# Altium schematic sheet isolator.SchDoc
size A
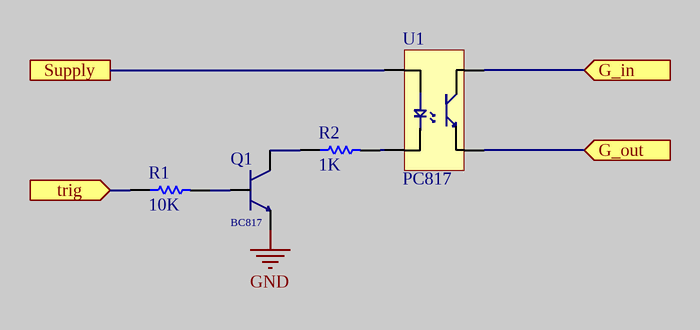
[diagram p0: isolator.SchDoc]

## Parts
Q1  NPN transistor  [NPN]  (value not drawn)
R1  10K  [RESC0603]
R2  1K  [RESC0603]
U1  PC817  [PC817]

## Ports
G_in (in), G_out (in), Supply, trig (in)

## Nets
GND: Q1.2(E)
G_in: U1.4 ; port G_in
G_out: U1.3 ; port G_out
Supply: U1.1 ; port Supply
trig: R1.1 ; port trig
NetQ1_1: Q1.1(B) R1.2
NetQ1_3: Q1.3(C) R2.1
NetR2_2: R2.2 U1.2

## Library data of the parts
Q1 = BC817: 45 V, 0.5 A; Transistor: BC817
R1 R2 = Resistor: 0603,0.1W; Published: 8-Jun-2000; LatestRevisionDate: 17-Jul-2002; LatestRevisionNote: Re-released for DXP Platform.; PackageReference: AXIAL-0.5; Publisher: Altium Limited
  R1: Value: 10K
  R2: Value: 1K
U1 = PC817: PC817 optocoupler